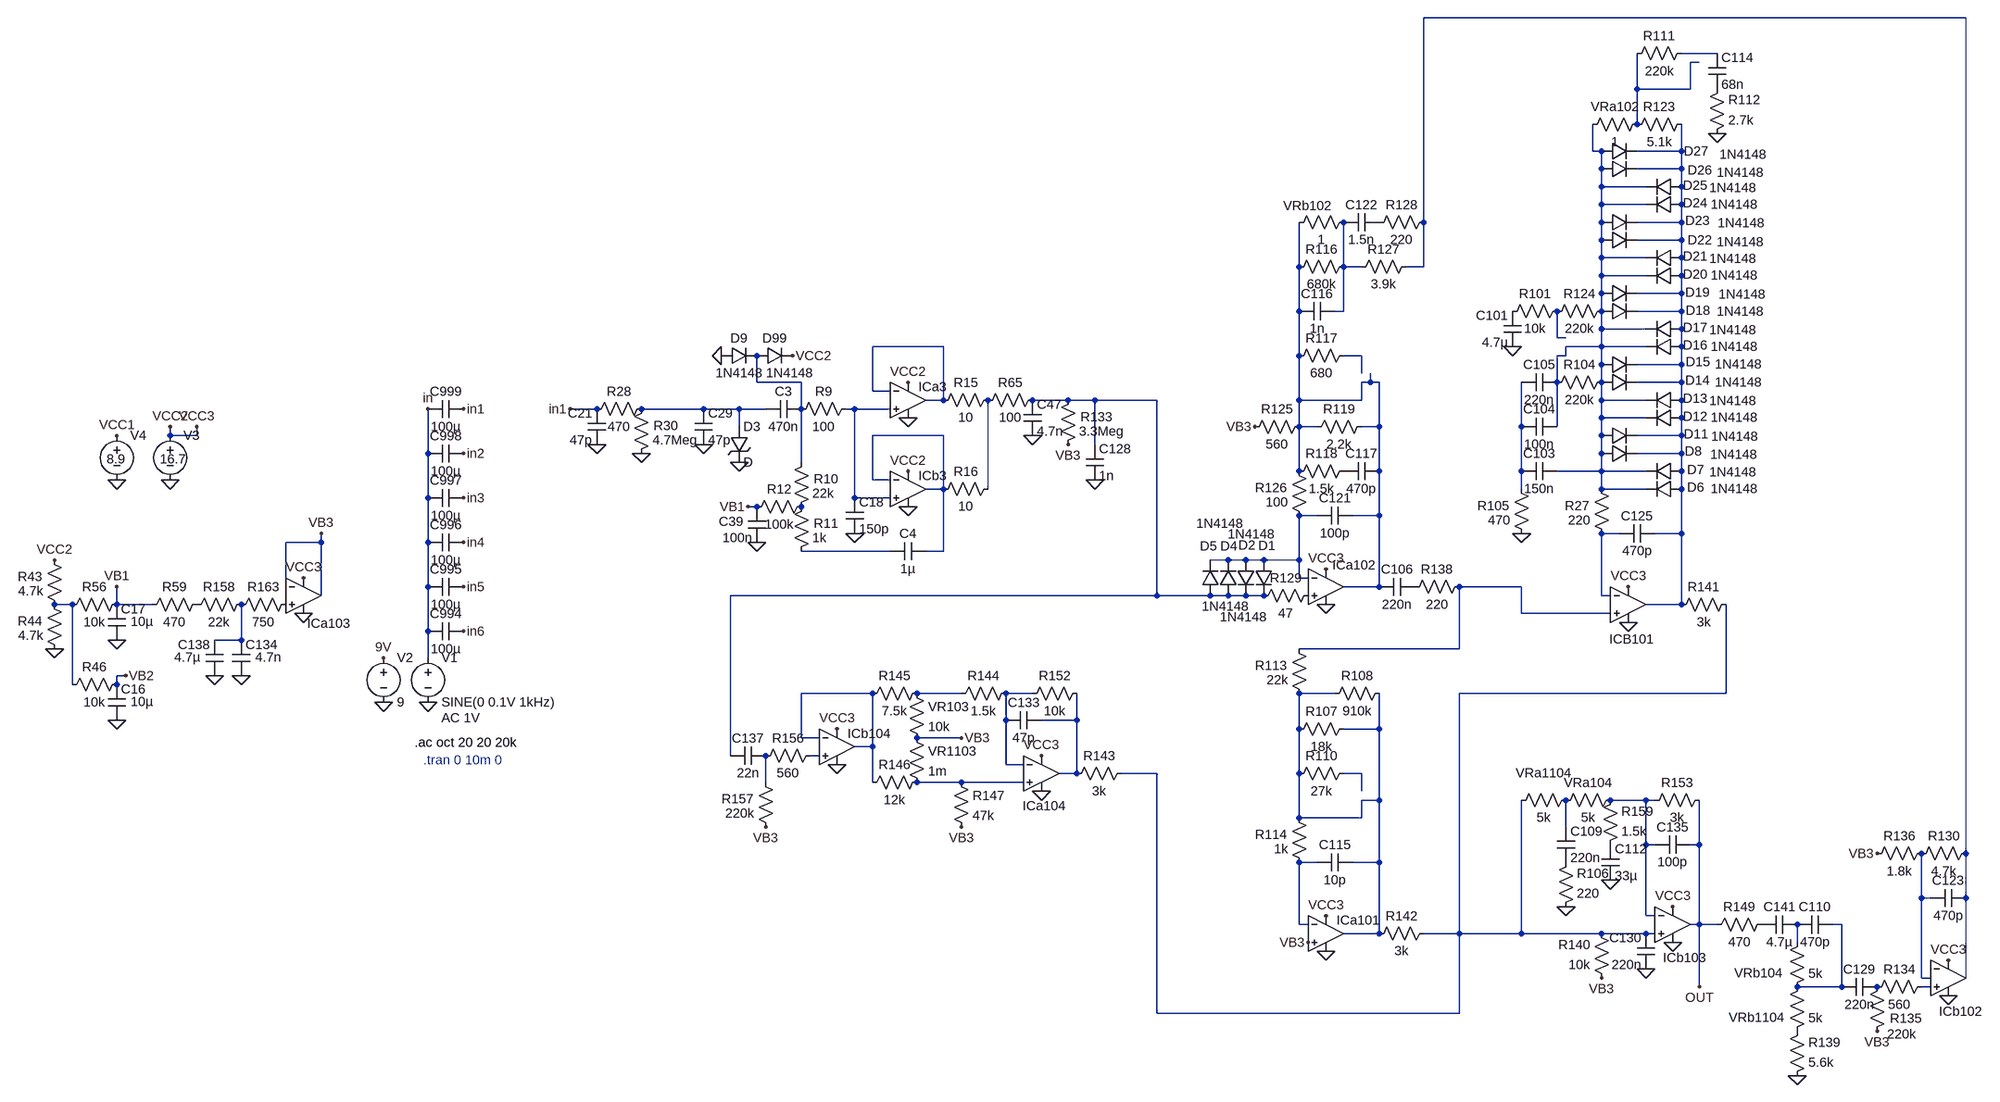
[diagram p0: schematic HalcyonGreenOD.asc]
HalcyonGreenOD.asc, the LTspice schematic file:
Version 4
SHEET 1 5440 4756
WIRE 704 384 -272 384
WIRE 256 448 192 448
WIRE 224 464 208 464
WIRE 112 512 112 448
WIRE 208 512 208 464
WIRE 208 512 112 512
WIRE 112 576 112 512
WIRE 32 624 32 576
WIRE 48 624 32 624
WIRE 192 624 192 576
WIRE 192 624 112 624
WIRE 48 656 48 624
WIRE 192 656 192 624
WIRE 192 656 112 656
WIRE 48 688 48 656
WIRE 128 688 48 688
WIRE 192 688 192 656
WIRE 48 720 48 688
WIRE 128 720 48 720
WIRE 192 720 192 688
WIRE -272 752 -272 384
WIRE 48 752 48 720
WIRE 192 752 192 720
WIRE 192 752 112 752
WIRE 48 784 48 752
WIRE 192 784 192 752
WIRE 192 784 112 784
WIRE 48 816 48 784
WIRE 128 816 48 816
WIRE 192 816 192 784
WIRE -496 832 -496 752
WIRE -416 832 -416 752
WIRE -384 832 -416 832
WIRE -272 832 -272 752
WIRE -272 832 -304 832
WIRE 48 848 48 816
WIRE 128 848 48 848
WIRE 192 848 192 816
WIRE 48 880 48 848
WIRE 192 880 192 848
WIRE 192 880 112 880
WIRE -496 912 -496 832
WIRE -416 912 -416 832
WIRE -416 912 -432 912
WIRE 48 912 48 880
WIRE 192 912 192 880
WIRE 192 912 112 912
WIRE 48 944 48 912
WIRE 128 944 48 944
WIRE 192 944 192 912
WIRE -32 960 -32 912
WIRE -16 960 -32 960
WIRE -1136 976 -1264 976
WIRE 48 976 48 944
WIRE 48 976 -16 976
WIRE 128 976 48 976
WIRE 192 976 192 944
WIRE -496 992 -496 912
WIRE -384 992 -416 992
WIRE -16 992 -16 976
WIRE -16 992 -32 992
WIRE 48 1008 48 976
WIRE 192 1008 192 976
WIRE 192 1008 112 1008
WIRE -384 1024 -384 992
WIRE -1472 1040 -1472 992
WIRE -1392 1040 -1472 1040
WIRE -368 1040 -368 1024
WIRE -368 1040 -384 1040
WIRE -352 1040 -368 1040
WIRE -32 1040 -32 992
WIRE 48 1040 48 1008
WIRE 192 1040 192 1008
WIRE 192 1040 112 1040
WIRE -1264 1056 -1264 976
WIRE -1232 1056 -1264 1056
WIRE -1136 1072 -1136 976
WIRE -1136 1072 -1168 1072
WIRE -912 1072 -976 1072
WIRE -864 1072 -912 1072
WIRE -752 1072 -864 1072
WIRE -496 1072 -496 992
WIRE -384 1072 -384 1040
WIRE -384 1072 -496 1072
WIRE 48 1072 48 1040
WIRE 128 1072 48 1072
WIRE 192 1072 192 1040
WIRE -1760 1088 -1808 1088
WIRE -1568 1088 -1680 1088
WIRE -1504 1088 -1568 1088
WIRE -1456 1088 -1504 1088
WIRE -1392 1088 -1392 1040
WIRE -1296 1088 -1312 1088
WIRE -1232 1088 -1296 1088
WIRE 48 1104 48 1072
WIRE 128 1104 48 1104
WIRE 192 1104 192 1072
WIRE -1504 1120 -1504 1088
WIRE -496 1120 -496 1072
WIRE -464 1120 -496 1120
WIRE -352 1120 -352 1040
WIRE -352 1120 -384 1120
WIRE -96 1120 -96 1040
WIRE -32 1120 -32 1040
WIRE -2528 1136 -2528 1120
WIRE -2480 1136 -2480 1120
WIRE -2480 1136 -2528 1136
WIRE -1136 1136 -1264 1136
WIRE 48 1136 48 1104
WIRE 192 1136 192 1104
WIRE 192 1136 112 1136
WIRE -864 1152 -864 1072
WIRE -2064 1168 -2064 1088
WIRE 48 1168 48 1136
WIRE 192 1168 192 1136
WIRE 192 1168 112 1168
WIRE -1392 1184 -1392 1088
WIRE -496 1200 -496 1120
WIRE -352 1200 -352 1120
WIRE -96 1200 -96 1120
WIRE 48 1200 48 1168
WIRE 48 1200 -32 1200
WIRE 128 1200 48 1200
WIRE 192 1200 192 1168
WIRE -1264 1216 -1264 1136
WIRE -1232 1216 -1264 1216
WIRE -1136 1232 -1136 1136
WIRE -1136 1232 -1168 1232
WIRE -1056 1232 -1056 1072
WIRE -96 1232 -96 1200
WIRE 48 1232 48 1200
WIRE 128 1232 48 1232
WIRE 192 1232 192 1200
WIRE -2064 1248 -2064 1168
WIRE -1296 1248 -1296 1088
WIRE -1232 1248 -1296 1248
WIRE -1472 1264 -1488 1264
WIRE -464 1280 -496 1280
WIRE -352 1280 -352 1200
WIRE -352 1280 -400 1280
WIRE 80 1312 48 1312
WIRE 192 1312 192 1232
WIRE 192 1312 144 1312
WIRE -2256 1328 -2256 1312
WIRE -2256 1328 -2320 1328
WIRE -2064 1328 -2064 1248
WIRE -1232 1344 -1392 1344
WIRE -1136 1344 -1136 1232
WIRE -1136 1344 -1168 1344
WIRE -624 1360 -656 1360
WIRE -592 1360 -624 1360
WIRE -560 1360 -592 1360
WIRE -496 1360 -496 1280
WIRE -496 1360 -560 1360
WIRE -496 1392 -496 1360
WIRE -480 1392 -496 1392
WIRE -2320 1408 -2320 1328
WIRE -2064 1408 -2064 1328
WIRE -352 1408 -352 1280
WIRE -352 1408 -416 1408
WIRE -96 1408 -208 1408
WIRE -2256 1424 -2256 1328
WIRE -752 1424 -752 1072
WIRE -752 1424 -1520 1424
WIRE -656 1424 -752 1424
WIRE -624 1424 -656 1424
WIRE -592 1424 -624 1424
WIRE -560 1424 -592 1424
WIRE 48 1424 48 1312
WIRE 64 1424 48 1424
WIRE -2704 1440 -2736 1440
WIRE -2624 1440 -2624 1408
WIRE -2560 1440 -2624 1440
WIRE 192 1440 192 1312
WIRE 192 1440 128 1440
WIRE -96 1456 -96 1408
WIRE 64 1456 -96 1456
WIRE -2064 1488 -2064 1408
WIRE -2400 1504 -2400 1440
WIRE -2400 1504 -2448 1504
WIRE -208 1520 -208 1408
WIRE -208 1520 -496 1520
WIRE -2064 1536 -2064 1488
WIRE -2608 1568 -2624 1568
WIRE -2704 1584 -2704 1440
WIRE -2624 1584 -2624 1568
WIRE -1264 1600 -1392 1600
WIRE -1104 1600 -1184 1600
WIRE -976 1600 -1024 1600
WIRE -432 1600 -496 1600
WIRE 272 1600 272 1440
WIRE 272 1600 -208 1600
WIRE -1024 1648 -1024 1600
WIRE -896 1648 -896 1600
WIRE -896 1648 -960 1648
WIRE -496 1664 -496 1600
WIRE -352 1664 -352 1600
WIRE -352 1664 -416 1664
WIRE -1392 1680 -1392 1600
WIRE -1360 1680 -1392 1680
WIRE -1104 1680 -1184 1680
WIRE -1264 1696 -1264 1600
WIRE -1264 1696 -1296 1696
WIRE -1520 1712 -1520 1424
WIRE -1360 1712 -1376 1712
WIRE -1024 1728 -1024 1648
WIRE -992 1728 -1024 1728
WIRE -896 1744 -896 1648
WIRE -896 1744 -928 1744
WIRE -752 1744 -816 1744
WIRE -496 1744 -496 1664
WIRE -384 1744 -416 1744
WIRE -1456 1760 -1456 1712
WIRE -1264 1760 -1264 1696
WIRE -1104 1760 -1184 1760
WIRE -992 1760 -1104 1760
WIRE -384 1776 -384 1744
WIRE -352 1792 -352 1664
WIRE -352 1792 -384 1792
WIRE 128 1792 64 1792
WIRE 144 1792 128 1792
WIRE -496 1824 -496 1744
WIRE -384 1824 -384 1792
WIRE -384 1824 -496 1824
WIRE -16 1840 -16 1792
WIRE 128 1872 128 1792
WIRE 144 1872 128 1872
WIRE 224 1872 224 1792
WIRE 224 1872 208 1872
WIRE 704 1888 704 384
WIRE -464 1904 -496 1904
WIRE -352 1904 -352 1792
WIRE -352 1904 -400 1904
WIRE 624 1968 624 1888
WIRE 640 1968 624 1968
WIRE 704 1968 704 1888
WIRE 128 2000 128 1872
WIRE 144 2000 128 2000
WIRE -496 2016 -496 1904
WIRE -480 2016 -496 2016
WIRE 224 2016 224 1872
WIRE 224 2016 208 2016
WIRE 256 2016 224 2016
WIRE 480 2016 464 2016
WIRE -352 2032 -352 1904
WIRE -352 2032 -416 2032
WIRE -208 2032 -208 1600
WIRE -208 2032 -272 2032
WIRE -96 2032 -96 1792
WIRE -96 2032 -208 2032
WIRE 48 2032 -96 2032
WIRE 128 2032 48 2032
WIRE 144 2032 128 2032
WIRE 400 2048 400 2016
WIRE 624 2112 624 1968
WIRE 640 2112 640 2096
WIRE 640 2112 624 2112
WIRE 704 2112 704 1968
WIRE 224 2128 224 2016
WIRE 480 2128 480 2016
WIRE 480 2128 400 2128
WIRE 640 2128 624 2128
WIRE -752 2176 -752 1744
WIRE -208 2176 -208 2032
WIRE -208 2176 -752 2176
FLAG -2064 1616 0
FLAG -2064 1088 in
FLAG -2144 1616 0
FLAG -2000 1088 in1
FLAG -2000 1168 in2
FLAG -2000 1248 in3
FLAG -2000 1328 in4
FLAG -2000 1408 in5
FLAG -2000 1488 in6
FLAG -1808 1088 in1
FLAG -2144 1536 9V
FLAG -1680 1168 0
FLAG -1760 1152 0
FLAG -1568 1152 0
FLAG -1504 1184 0
FLAG -2624 1216 0
FLAG -2624 1136 VCC1
FLAG -1488 1264 VB1
FLAG -1472 1328 0
FLAG -1328 1664 VCC3
FLAG -1328 1728 0
FLAG -960 1712 VCC3
FLAG -960 1776 0
FLAG -1456 1840 VB3
FLAG -1104 1840 VB3
FLAG -1104 1680 VB3
FLAG -2528 1216 0
FLAG -2528 1120 VCC2
FLAG -2480 1120 VCC3
FLAG -2736 1360 VCC2
FLAG -2736 1520 0
FLAG -2624 1504 0
FLAG -2624 1648 0
FLAG -2624 1408 VB1
FLAG -2608 1568 VB2
FLAG -2448 1568 0
FLAG -2400 1568 0
FLAG -2288 1456 0
FLAG -2288 1392 VCC3
FLAG -2256 1312 VB3
FLAG -1536 992 0
FLAG -1408 992 VCC2
FLAG -1200 1104 0
FLAG -1200 1040 VCC2
FLAG -1200 1264 0
FLAG -1200 1200 VCC2
FLAG -1296 1312 0
FLAG -976 1136 0
FLAG -864 1216 0
FLAG -912 1152 VB3
FLAG -448 1376 VCC3
FLAG -448 1440 0
FLAG -576 1120 VB3
FLAG -448 2000 VCC3
FLAG -448 2064 0
FLAG -480 2048 VB3
FLAG 96 1408 VCC3
FLAG 96 1472 0
FLAG -96 1312 0
FLAG -112 976 0
FLAG 256 592 0
FLAG 176 1984 VCC3
FLAG 176 2048 0
FLAG 128 2096 0
FLAG 48 2112 VB3
FLAG 64 1936 0
FLAG -16 1984 0
FLAG 400 2288 0
FLAG 544 2208 VB3
FLAG 672 2144 0
FLAG 672 2080 VCC3
FLAG 544 1888 VB3
FLAG 224 2128 OUT
SYMBOL voltage -2064 1520 R0
WINDOW 123 24 124 Left 2
WINDOW 39 0 0 Left 2
SYMATTR Value2 AC 1V
SYMATTR InstName V1
SYMATTR Value SINE(0 0.1V 1kHz)
SYMBOL voltage -2144 1520 R0
WINDOW 123 0 0 Left 0
WINDOW 39 0 0 Left 0
SYMATTR InstName V2
SYMATTR Value 9
SYMBOL cap -2000 1152 R90
WINDOW 0 0 32 VBottom 2
WINDOW 3 32 32 VTop 2
SYMATTR InstName C998
SYMATTR Value 100µ
SYMBOL cap -2000 1232 R90
WINDOW 0 0 32 VBottom 2
WINDOW 3 32 32 VTop 2
SYMATTR InstName C997
SYMATTR Value 100µ
SYMBOL cap -2000 1312 R90
WINDOW 0 0 32 VBottom 2
WINDOW 3 32 32 VTop 2
SYMATTR InstName C996
SYMATTR Value 100µ
SYMBOL cap -2000 1072 R90
WINDOW 0 0 32 VBottom 2
WINDOW 3 32 32 VTop 2
SYMATTR InstName C999
SYMATTR Value 100µ
SYMBOL cap -2000 1392 R90
WINDOW 0 0 32 VBottom 2
WINDOW 3 32 32 VTop 2
SYMATTR InstName C995
SYMATTR Value 100µ
SYMBOL cap -2000 1472 R90
WINDOW 0 0 32 VBottom 2
WINDOW 3 32 32 VTop 2
SYMATTR InstName C994
SYMATTR Value 100µ
SYMBOL cap -1744 1152 R180
WINDOW 0 24 56 Left 2
WINDOW 3 24 8 Left 2
SYMATTR InstName C21
SYMATTR Value 47p
SYMBOL res -1696 1184 M180
WINDOW 0 38 66 Left 2
WINDOW 3 36 40 Left 2
SYMATTR InstName R30
SYMATTR Value 4.7Meg
SYMBOL res -1664 1072 R90
WINDOW 0 0 56 VBottom 2
WINDOW 3 32 56 VTop 2
SYMATTR InstName R28
SYMATTR Value 470
SYMBOL cap -1584 1152 M180
WINDOW 0 24 56 Left 2
WINDOW 3 24 8 Left 2
SYMATTR InstName C29
SYMATTR Value 47p
SYMBOL TVSdiode -1520 1120 R0
SYMATTR InstName D3
SYMBOL cap -1392 1072 R90
WINDOW 0 0 32 VBottom 2
WINDOW 3 32 32 VTop 2
SYMATTR InstName C3
SYMATTR Value 470n
SYMBOL res -1408 1280 M180
WINDOW 0 38 66 Left 2
WINDOW 3 36 40 Left 2
SYMATTR InstName R10
SYMATTR Value 22k
SYMBOL voltage -2624 1120 R0
WINDOW 123 0 0 Left 0
WINDOW 39 0 0 Left 0
WINDOW 3 -18 58 Left 2
SYMATTR Value 8.9
SYMATTR InstName V4
SYMBOL res -1488 1280 R270
WINDOW 0 32 56 VTop 2
WINDOW 3 0 56 VBottom 2
SYMATTR InstName R12
SYMATTR Value 100k
SYMBOL cap -1456 1328 R180
WINDOW 0 40 37 Left 2
WINDOW 3 24 8 Left 2
SYMATTR InstName C39
SYMATTR Value 100n
SYMBOL diode -1472 976 M90
WINDOW 0 0 32 VBottom 2
WINDOW 3 32 59 VTop 2
SYMATTR InstName D99
SYMATTR Value 1N4148
SYMBOL Opamps\\UniversalOpamp2 -1328 1696 R0
WINDOW 0 19 -24 Left 2
SYMATTR InstName ICb104
SYMBOL cap -1456 1696 R90
WINDOW 0 0 32 VBottom 2
WINDOW 3 32 32 VTop 2
SYMATTR InstName C137
SYMATTR Value 22n
SYMBOL res -1440 1856 R180
WINDOW 0 38 66 Left 2
WINDOW 3 36 40 Left 2
SYMATTR InstName R157
SYMATTR Value 220k
SYMBOL res -1360 1696 R90
WINDOW 0 0 56 VBottom 2
WINDOW 3 32 56 VTop 2
SYMATTR InstName R156
SYMATTR Value 560
SYMBOL res -1168 1584 R90
WINDOW 0 0 56 VBottom 2
WINDOW 3 32 56 VTop 2
SYMATTR InstName R145
SYMATTR Value 7.5k
SYMBOL res -1168 1744 R90
WINDOW 0 0 56 VBottom 2
WINDOW 3 32 56 VTop 2
SYMATTR InstName R146
SYMATTR Value 12k
SYMBOL res -1200 1584 R0
SYMATTR InstName VR103
SYMATTR Value 10k
SYMBOL res -1200 1664 R0
SYMATTR InstName VR1103
SYMATTR Value 1m
SYMBOL res -1120 1744 R0
SYMATTR InstName R147
SYMATTR Value 47k
SYMBOL Opamps\\UniversalOpamp2 -960 1744 R0
WINDOW 0 -34 58 Left 2
SYMATTR InstName ICa104
SYMBOL res -1008 1584 R90
WINDOW 0 0 56 VBottom 2
WINDOW 3 32 56 VTop 2
SYMATTR InstName R144
SYMATTR Value 1.5k
SYMBOL cap -960 1632 R90
WINDOW 0 0 32 VBottom 2
WINDOW 3 32 32 VTop 2
SYMATTR InstName C133
SYMATTR Value 47p
SYMBOL res -880 1584 R90
WINDOW 0 0 56 VBottom 2
WINDOW 3 32 56 VTop 2
SYMATTR InstName R152
SYMATTR Value 10k
SYMBOL voltage -2528 1120 R0
WINDOW 123 0 0 Left 0
WINDOW 39 0 0 Left 0
WINDOW 3 -18 58 Left 2
SYMATTR Value 16.7
SYMATTR InstName V3
SYMBOL res -2720 1456 R180
WINDOW 0 38 66 Left 2
WINDOW 3 36 40 Left 2
SYMATTR InstName R43
SYMATTR Value 4.7k
SYMBOL res -2720 1536 R180
WINDOW 0 38 66 Left 2
WINDOW 3 36 40 Left 2
SYMATTR InstName R44
SYMATTR Value 4.7k
SYMBOL res -2608 1424 R90
WINDOW 0 0 56 VBottom 2
WINDOW 3 32 56 VTop 2
SYMATTR InstName R56
SYMATTR Value 10k
SYMBOL res -2608 1568 R90
WINDOW 0 0 56 VBottom 2
WINDOW 3 32 56 VTop 2
SYMATTR InstName R46
SYMATTR Value 10k
SYMBOL cap -2640 1504 M180
WINDOW 0 24 56 Left 2
WINDOW 3 41 33 Left 2
SYMATTR InstName C17
SYMATTR Value 10µ
SYMBOL cap -2640 1648 M180
WINDOW 0 24 56 Left 2
WINDOW 3 41 33 Left 2
SYMATTR InstName C16
SYMATTR Value 10µ
SYMBOL res -2464 1424 R90
WINDOW 0 0 56 VBottom 2
WINDOW 3 32 56 VTop 2
SYMATTR InstName R59
SYMATTR Value 470
SYMBOL res -2384 1424 R90
WINDOW 0 0 56 VBottom 2
WINDOW 3 32 56 VTop 2
SYMATTR InstName R158
SYMATTR Value 22k
SYMBOL res -2304 1424 R90
WINDOW 0 0 56 VBottom 2
WINDOW 3 32 56 VTop 2
SYMATTR InstName R163
SYMATTR Value 750
SYMBOL cap -2432 1568 R180
WINDOW 0 24 56 Left 2
WINDOW 3 41 33 Left 2
SYMATTR InstName C138
SYMATTR Value 4.7µ
SYMBOL cap -2416 1568 M180
WINDOW 0 24 56 Left 2
WINDOW 3 41 33 Left 2
SYMATTR InstName C134
SYMATTR Value 4.7n
SYMBOL Opamps\\UniversalOpamp2 -2288 1424 R0
WINDOW 0 7 50 Left 2
SYMATTR InstName ICa103
SYMBOL diode -1536 976 M90
WINDOW 0 0 32 VBottom 2
WINDOW 3 32 32 VTop 2
SYMATTR InstName D9
SYMATTR Value 1N4148
SYMBOL Opamps\\UniversalOpamp2 -1200 1072 R0
WINDOW 0 19 -24 Left 2
SYMATTR InstName ICa3
SYMBOL res -1296 1072 R90
WINDOW 0 0 56 VBottom 2
WINDOW 3 32 56 VTop 2
SYMATTR InstName R9
SYMATTR Value 100
SYMBOL Opamps\\UniversalOpamp2 -1200 1232 R0
WINDOW 0 19 -24 Left 2
SYMATTR InstName ICb3
SYMBOL cap -1312 1312 M180
WINDOW 0 24 56 Left 2
WINDOW 3 24 8 Left 2
SYMATTR InstName C18
SYMATTR Value 150p
SYMBOL cap -1168 1328 R90
WINDOW 0 0 32 VBottom 2
WINDOW 3 32 32 VTop 2
SYMATTR InstName C4
SYMATTR Value 1µ
SYMBOL res -1408 1360 M180
WINDOW 0 38 66 Left 2
WINDOW 3 36 40 Left 2
SYMATTR InstName R11
SYMATTR Value 1k
SYMBOL res -1040 1056 R90
WINDOW 0 0 56 VBottom 2
WINDOW 3 32 56 VTop 2
SYMATTR InstName R15
SYMATTR Value 10
SYMBOL res -1040 1216 R90
WINDOW 0 0 56 VBottom 2
WINDOW 3 32 56 VTop 2
SYMATTR InstName R16
SYMATTR Value 10
SYMBOL res -464 1408 R90
WINDOW 0 0 56 VBottom 2
WINDOW 3 32 56 VTop 2
SYMATTR InstName R129
SYMATTR Value 47
SYMBOL cap -992 1136 M180
WINDOW 0 24 56 Left 2
WINDOW 3 24 8 Left 2
SYMATTR InstName C47
SYMATTR Value 4.7n
SYMBOL res -928 1168 M180
WINDOW 0 38 66 Left 2
WINDOW 3 36 40 Left 2
SYMATTR InstName R133
SYMATTR Value 3.3Meg
SYMBOL cap -880 1216 M180
WINDOW 0 24 56 Left 2
WINDOW 3 24 8 Left 2
SYMATTR InstName C128
SYMATTR Value 1n
SYMBOL Opamps\\UniversalOpamp2 -448 1408 R0
WINDOW 0 12 -39 Left 2
SYMATTR InstName ICa102
SYMBOL diode -544 1360 M0
WINDOW 0 -5 -26 Left 2
WINDOW 3 10 102 Left 2
SYMATTR InstName D1
SYMATTR Value 1N4148
SYMBOL diode -576 1360 M0
WINDOW 0 -1 -27 Left 2
WINDOW 3 -36 -47 Left 2
SYMATTR InstName D2
SYMATTR Value 1N4148
SYMBOL diode -640 1424 M180
WINDOW 0 2 89 Left 2
WINDOW 3 -31 -19 Left 2
SYMATTR InstName D4
SYMATTR Value 1N4148
SYMBOL diode -672 1424 M180
WINDOW 0 -3 89 Left 2
WINDOW 3 -9 130 Left 2
SYMATTR InstName D5
SYMATTR Value 1N4148
SYMBOL cap -464 1264 M90
WINDOW 0 0 32 VBottom 2
WINDOW 3 32 32 VTop 2
SYMATTR InstName C121
SYMATTR Value 100p
SYMBOL cap -416 1184 M90
WINDOW 0 0 32 VBottom 2
WINDOW 3 32 32 VTop 2
SYMATTR InstName C117
SYMATTR Value 470p
SYMBOL res -400 1184 R90
WINDOW 0 0 56 VBottom 2
WINDOW 3 32 56 VTop 2
SYMATTR InstName R118
SYMATTR Value 1.5k
SYMBOL res -480 1104 R90
WINDOW 0 0 56 VBottom 2
WINDOW 3 32 56 VTop 2
SYMATTR InstName R125
SYMATTR Value 560
SYMBOL res -960 1056 R90
WINDOW 0 0 56 VBottom 2
WINDOW 3 32 56 VTop 2
SYMATTR InstName R65
SYMATTR Value 100
SYMBOL res -400 976 R90
WINDOW 0 0 56 VBottom 2
WINDOW 3 32 56 VTop 2
SYMATTR InstName R117
SYMATTR Value 680
SYMBOL cap -496 896 M90
WINDOW 0 0 32 VBottom 2
WINDOW 3 32 32 VTop 2
SYMATTR InstName C116
SYMATTR Value 1n
SYMBOL res -400 816 R90
WINDOW 0 0 56 VBottom 2
WINDOW 3 32 56 VTop 2
SYMATTR InstName R116
SYMATTR Value 680k
SYMBOL res -400 736 R90
WINDOW 0 2 81 VBottom 2
WINDOW 3 32 56 VTop 2
SYMATTR InstName VRb102
SYMATTR Value 1
SYMBOL cap -416 736 M90
WINDOW 0 0 32 VBottom 2
WINDOW 3 32 32 VTop 2
SYMATTR InstName C122
SYMATTR Value 1.5n
SYMBOL res -256 736 R90
WINDOW 0 0 56 VBottom 2
WINDOW 3 32 56 VTop 2
SYMATTR InstName R128
SYMATTR Value 220
SYMBOL res -288 816 R90
WINDOW 0 0 56 VBottom 2
WINDOW 3 32 56 VTop 2
SYMATTR InstName R127
SYMATTR Value 3.9k
SYMBOL cap -352 1392 M90
WINDOW 0 0 32 VBottom 2
WINDOW 3 32 32 VTop 2
SYMATTR InstName C106
SYMATTR Value 220n
SYMBOL res -192 1392 R90
WINDOW 0 0 56 VBottom 2
WINDOW 3 32 56 VTop 2
SYMATTR InstName R138
SYMATTR Value 220
SYMBOL res -480 1296 R180
WINDOW 0 38 66 Left 2
WINDOW 3 36 40 Left 2
SYMATTR InstName R126
SYMATTR Value 100
SYMBOL Opamps\\UniversalOpamp2 -448 2032 R0
WINDOW 0 19 -24 Left 2
SYMATTR InstName ICa101
SYMBOL cap -464 1888 M90
WINDOW 0 0 32 VBottom 2
WINDOW 3 32 32 VTop 2
SYMATTR InstName C115
SYMATTR Value 10p
SYMBOL res -400 1728 R90
WINDOW 0 0 56 VBottom 2
WINDOW 3 32 56 VTop 2
SYMATTR InstName R110
SYMATTR Value 27k
SYMBOL res -400 1648 R90
WINDOW 0 0 56 VBottom 2
WINDOW 3 32 56 VTop 2
SYMATTR InstName R107
SYMATTR Value 18k
SYMBOL res -336 1584 R90
WINDOW 0 0 56 VBottom 2
WINDOW 3 32 56 VTop 2
SYMATTR InstName R108
SYMATTR Value 910k
SYMBOL res -256 2016 R90
WINDOW 0 0 56 VBottom 2
WINDOW 3 32 56 VTop 2
SYMATTR InstName R142
SYMATTR Value 3k
SYMBOL res -480 1920 R180
WINDOW 0 38 66 Left 2
WINDOW 3 36 40 Left 2
SYMATTR InstName R114
SYMATTR Value 1k
SYMBOL res -480 1616 R180
WINDOW 0 38 66 Left 2
WINDOW 3 36 40 Left 2
SYMATTR InstName R113
SYMATTR Value 22k
SYMBOL Opamps\\UniversalOpamp2 96 1440 R0
WINDOW 0 -34 62 Left 2
SYMATTR InstName ICB101
SYMBOL cap 80 1296 M90
WINDOW 0 0 32 VBottom 2
WINDOW 3 32 32 VTop 2
SYMATTR InstName C125
SYMATTR Value 470p
SYMBOL res 288 1424 R90
WINDOW 0 0 56 VBottom 2
WINDOW 3 32 56 VTop 2
SYMATTR InstName R141
SYMATTR Value 3k
SYMBOL res 64 1328 R180
WINDOW 0 38 66 Left 2
WINDOW 3 36 40 Left 2
SYMATTR InstName R27
SYMATTR Value 220
SYMBOL diode 192 1248 M270
WINDOW 0 3 -25 VTop 2
WINDOW 3 32 -95 VBottom 2
SYMATTR InstName D6
SYMATTR Value 1N4148
SYMBOL diode 192 1216 M270
WINDOW 0 3 -25 VTop 2
WINDOW 3 30 -92 VBottom 2
SYMATTR InstName D7
SYMATTR Value 1N4148
SYMBOL diode 48 1184 R270
WINDOW 0 4 165 VTop 2
WINDOW 3 30 238 VBottom 2
SYMATTR InstName D8
SYMATTR Value 1N4148
SYMBOL diode 48 1152 R270
WINDOW 0 3 170 VTop 2
WINDOW 3 30 240 VBottom 2
SYMATTR InstName D11
SYMATTR Value 1N4148
SYMBOL diode 192 1120 M270
WINDOW 0 3 -25 VTop 2
WINDOW 3 32 -95 VBottom 2
SYMATTR InstName D12
SYMATTR Value 1N4148
SYMBOL diode 192 1088 M270
WINDOW 0 3 -25 VTop 2
WINDOW 3 30 -92 VBottom 2
SYMATTR InstName D13
SYMATTR Value 1N4148
SYMBOL diode 48 1056 R270
WINDOW 0 4 173 VTop 2
WINDOW 3 32 246 VBottom 2
SYMATTR InstName D14
SYMATTR Value 1N4148
SYMBOL diode 48 1024 R270
WINDOW 0 5 174 VTop 2
WINDOW 3 32 246 VBottom 2
SYMATTR InstName D15
SYMATTR Value 1N4148
SYMBOL diode 192 992 M270
WINDOW 0 3 -25 VTop 2
WINDOW 3 32 -95 VBottom 2
SYMATTR InstName D16
SYMATTR Value 1N4148
SYMBOL diode 192 960 M270
WINDOW 0 3 -25 VTop 2
WINDOW 3 30 -92 VBottom 2
SYMATTR InstName D17
SYMATTR Value 1N4148
SYMBOL diode 48 928 R270
WINDOW 0 2 174 VTop 2
WINDOW 3 31 250 VBottom 2
SYMATTR InstName D18
SYMATTR Value 1N4148
SYMBOL diode 48 896 R270
WINDOW 0 2 173 VTop 2
WINDOW 3 30 253 VBottom 2
SYMATTR InstName D19
SYMATTR Value 1N4148
SYMBOL diode 192 864 M270
WINDOW 0 3 -25 VTop 2
WINDOW 3 32 -95 VBottom 2
SYMATTR InstName D20
SYMATTR Value 1N4148
SYMBOL diode 192 832 M270
WINDOW 0 3 -25 VTop 2
WINDOW 3 30 -92 VBottom 2
SYMATTR InstName D21
SYMATTR Value 1N4148
SYMBOL diode 48 800 R270
WINDOW 0 0 177 VTop 2
WINDOW 3 28 250 VBottom 2
SYMATTR InstName D22
SYMATTR Value 1N4148
SYMBOL diode 48 768 R270
WINDOW 0 3 173 VTop 2
WINDOW 3 30 251 VBottom 2
SYMATTR InstName D23
SYMATTR Value 1N4148
SYMBOL diode 192 736 M270
WINDOW 0 3 -25 VTop 2
WINDOW 3 32 -95 VBottom 2
SYMATTR InstName D24
SYMATTR Value 1N4148
SYMBOL diode 192 704 M270
WINDOW 0 3 -25 VTop 2
WINDOW 3 30 -92 VBottom 2
SYMATTR InstName D25
SYMATTR Value 1N4148
SYMBOL diode 48 672 R270
WINDOW 0 -2 177 VTop 2
WINDOW 3 25 250 VBottom 2
SYMATTR InstName D26
SYMATTR Value 1N4148
SYMBOL diode 48 640 R270
WINDOW 0 0 170 VTop 2
WINDOW 3 26 255 VBottom 2
SYMATTR InstName D27
SYMATTR Value 1N4148
SYMBOL res 64 1024 R90
WINDOW 0 0 56 VBottom 2
WINDOW 3 32 56 VTop 2
SYMATTR InstName R104
SYMATTR Value 220k
SYMBOL cap -96 1024 M90
WINDOW 0 0 32 VBottom 2
WINDOW 3 32 32 VTop 2
SYMATTR InstName C105
SYMATTR Value 220n
SYMBOL cap -96 1104 M90
WINDOW 0 0 32 VBottom 2
WINDOW 3 32 32 VTop 2
SYMATTR InstName C104
SYMATTR Value 100n
SYMBOL cap -96 1184 M90
WINDOW 0 0 32 VBottom 2
WINDOW 3 32 32 VTop 2
SYMATTR InstName C103
SYMATTR Value 150n
SYMBOL res -80 1328 R180
WINDOW 0 38 66 Left 2
WINDOW 3 36 40 Left 2
SYMATTR InstName R105
SYMATTR Value 470
SYMBOL res 64 896 R90
WINDOW 0 0 56 VBottom 2
WINDOW 3 32 56 VTop 2
SYMATTR InstName R124
SYMATTR Value 220k
SYMBOL res -16 896 R90
WINDOW 0 0 56 VBottom 2
WINDOW 3 32 56 VTop 2
SYMATTR InstName R101
SYMATTR Value 10k
SYMBOL cap -96 912 M0
SYMATTR InstName C101
SYMATTR Value 4.7µ
SYMBOL res 208 560 R90
WINDOW 0 0 56 VBottom 2
WINDOW 3 32 56 VTop 2
SYMATTR InstName R123
SYMATTR Value 5.1k
SYMBOL res 128 560 R90
WINDOW 0 0 56 VBottom 2
WINDOW 3 32 56 VTop 2
SYMATTR InstName VRa102
SYMATTR Value 1
SYMBOL res 208 432 R90
WINDOW 0 0 56 VBottom 2
WINDOW 3 32 56 VTop 2
SYMATTR InstName R111
SYMATTR Value 220k
SYMBOL cap 240 448 R0
SYMATTR InstName C114
SYMATTR Value 68n
SYMBOL res 240 608 M180
WINDOW 0 36 76 Left 2
WINDOW 3 36 40 Left 2
SYMATTR InstName R112
SYMATTR Value 2.7k
SYMBOL res -800 1728 R90
WINDOW 0 0 56 VBottom 2
WINDOW 3 32 56 VTop 2
SYMATTR InstName R143
SYMATTR Value 3k
SYMBOL Opamps\\UniversalOpamp2 176 2016 R0
WINDOW 0 -17 60 Left 2
SYMATTR InstName ICb103
SYMBOL cap 144 1856 M90
WINDOW 0 0 32 VBottom 2
WINDOW 3 32 32 VTop 2
SYMATTR InstName C135
SYMATTR Value 100p
SYMBOL res 240 1776 R90
WINDOW 0 0 56 VBottom 2
WINDOW 3 32 56 VTop 2
SYMATTR InstName R153
SYMATTR Value 3k
SYMBOL cap 144 2032 M0
SYMATTR InstName C130
SYMATTR Value 220n
SYMBOL res 64 2128 R180
WINDOW 0 36 76 Left 2
WINDOW 3 36 40 Left 2
SYMATTR InstName R140
SYMATTR Value 10k
SYMBOL res 48 1888 M180
WINDOW 0 36 76 Left 2
WINDOW 3 36 40 Left 2
SYMATTR InstName R159
SYMATTR Value 1.5k
SYMBOL cap 48 1872 R0
SYMATTR InstName C112
SYMATTR Value 33µ
SYMBOL res 80 1776 R90
WINDOW 0 0 56 VBottom 2
WINDOW 3 32 56 VTop 2
SYMATTR InstName VRa104
SYMATTR Value 5k
SYMBOL res 0 1776 R90
WINDOW 0 -17 56 VBottom 2
WINDOW 3 32 56 VTop 2
SYMATTR InstName VRa1104
SYMATTR Value 5k
SYMBOL cap -32 1840 R0
SYMATTR InstName C109
SYMATTR Value 220n
SYMBOL res -32 2000 M180
WINDOW 0 36 76 Left 2
WINDOW 3 36 40 Left 2
SYMATTR InstName R106
SYMATTR Value 220
SYMBOL res 352 2000 R90
WINDOW 0 0 56 VBottom 2
WINDOW 3 32 56 VTop 2
SYMATTR InstName R149
SYMATTR Value 470
SYMBOL cap 336 2000 M90
WINDOW 0 0 32 VBottom 2
WINDOW 3 32 32 VTop 2
SYMATTR InstName C141
SYMATTR Value 4.7µ
SYMBOL cap 400 2000 M90
WINDOW 0 0 32 VBottom 2
WINDOW 3 32 32 VTop 2
SYMATTR InstName C110
SYMATTR Value 470p
SYMBOL res 384 2144 M180
WINDOW 0 -97 41 Left 2
WINDOW 3 36 40 Left 2
SYMATTR InstName VRb104
SYMATTR Value 5k
SYMBOL res 384 2224 M180
WINDOW 0 -107 41 Left 2
WINDOW 3 36 40 Left 2
SYMATTR InstName VRb1104
SYMATTR Value 5k
SYMBOL res 384 2304 M180
WINDOW 0 36 76 Left 2
WINDOW 3 36 40 Left 2
SYMATTR InstName R139
SYMATTR Value 5.6k
SYMBOL cap 544 2112 R90
WINDOW 0 0 32 VBottom 2
WINDOW 3 32 32 VTop 2
SYMATTR InstName C129
SYMATTR Value 220n
SYMBOL res 528 2224 M180
WINDOW 0 39 39 Left 2
WINDOW 3 34 11 Left 2
SYMATTR InstName R135
SYMATTR Value 220k
SYMBOL res 640 2112 R90
WINDOW 0 0 56 VBottom 2
WINDOW 3 32 56 VTop 2
SYMATTR InstName R134
SYMATTR Value 560
SYMBOL Opamps\\UniversalOpamp2 672 2112 R0
WINDOW 0 -17 60 Left 2
SYMATTR InstName ICb102
SYMBOL cap 640 1952 M90
WINDOW 0 0 32 VBottom 2
WINDOW 3 32 32 VTop 2
SYMATTR InstName C123
SYMATTR Value 470p
SYMBOL res 720 1872 R90
WINDOW 0 0 56 VBottom 2
WINDOW 3 32 56 VTop 2
SYMATTR InstName R130
SYMATTR Value 4.7k
SYMBOL res 640 1872 R90
WINDOW 0 0 56 VBottom 2
WINDOW 3 32 56 VTop 2
SYMATTR InstName R136
SYMATTR Value 1.8k
SYMBOL res -368 1104 R90
WINDOW 0 0 56 VBottom 2
WINDOW 3 32 56 VTop 2
SYMATTR InstName R119
SYMATTR Value 2.2k
TEXT -2088 1688 Left 2 !.ac oct 20 20 20k
TEXT -2072 1720 Left 2 ;.tran 0 10m 0

The netlist it stands for:
* HalcyonGreenOD.asc
V1 in 0 SINE(0 0.1V 1kHz) AC 1V
V2 9V 0 9
C998 in2 in 100µ
C997 in3 in 100µ
C996 in4 in 100µ
C999 in1 in 100µ
C995 in5 in 100µ
C994 in6 in 100µ
C21 0 in1 47p
R30 0 N013 4.7Meg
R28 N013 in1 470
C29 0 N013 47p
D3 N013 0 D
C3 N011 N013 470n
R10 P001 N011 22k
V4 VCC1 0 8.9
R12 VB1 P001 100k
C39 0 VB1 100n
D99 N011 VCC2 1N4148
XICb104 N030 N024 VCC2 0 N024 level.2 Avol=1Meg GBW=10Meg Slew=10Meg ilimit=25m rail=0 Vos=0 phimargin=45 en=0 enk=0 in=0 ink=0 Rin=500Meg  ; pins IN+ IN- V+ V- OUT
C137 N032 N012 22n
R157 VB3 N032 220k
R156 N030 N032 560
R145 N025 N024 7.5k
R146 N033 N024 12k
R§VR103 N025 VB3 10k
R§VR1103 VB3 N033 1m
R147 N033 VB3 47k
XICa104 N033 N026 VCC2 0 N029 level.2 Avol=1Meg GBW=10Meg Slew=10Meg ilimit=25m rail=0 Vos=0 phimargin=45 en=0 enk=0 in=0 ink=0 Rin=500Meg  ; pins IN+ IN- V+ V- OUT
R144 N026 N025 1.5k
C133 N029 N026 47p
R152 N029 N026 10k
V3 VCC2 0 16.7
R43 N022 VCC2 4.7k
R44 0 N022 4.7k
R56 VB1 N022 10k
R46 VB2 N022 10k
C17 0 VB1 10µ
C16 0 VB2 10µ
R59 P002 VB1 470
R158 N023 P002 22k
R163 P003 N023 750
C138 0 N023 4.7µ
C134 0 N023 4.7n
XICa103 P003 VB3 VCC2 0 VB3 level.2 Avol=1Meg GBW=10Meg Slew=10Meg ilimit=25m rail=0 Vos=0 phimargin=45 en=0 enk=0 in=0 ink=0 Rin=500Meg  ; pins IN+ IN- V+ V- OUT
D9 0 N011 1N4148
XICa3 N014 N009 VCC2 0 N009 level.2 Avol=1Meg GBW=10Meg Slew=10Meg ilimit=25m rail=0 Vos=0 phimargin=45 en=0 enk=0 in=0 ink=0 Rin=500Meg  ; pins IN+ IN- V+ V- OUT
R9 N014 N011 100
XICb3 N014 N016 VCC2 0 N016 level.2 Avol=1Meg GBW=10Meg Slew=10Meg ilimit=25m rail=0 Vos=0 phimargin=45 en=0 enk=0 in=0 ink=0 Rin=500Meg  ; pins IN+ IN- V+ V- OUT
C18 0 N014 150p
C4 N016 N020 1µ
R11 N020 P001 1k
R15 N017 N009 10
R16 N017 N016 10
R129 P004 N012 47
C47 0 N012 4.7n
R133 VB3 N012 3.3Meg
C128 0 N012 1n
XICa102 P004 N018 VCC2 0 N006 level.2 Avol=1Meg GBW=10Meg Slew=10Meg ilimit=25m rail=0 Vos=0 phimargin=45 en=0 enk=0 in=0 ink=0 Rin=500Meg  ; pins IN+ IN- V+ V- OUT
D1 N018 N012 1N4148
D2 N018 N012 1N4148
D4 N012 N018 1N4148
D5 N012 N018 1N4148
C121 N018 N006 100p
C117 P005 N006 470p
R118 P005 N006 1.5k
R125 N006 VB3 560
R65 N012 N017 100
R117 N010 N006 680
C116 N006 N007 1n
R116 N007 N006 680k
R§VRb102 N007 N006 1
C122 N007 P006 1.5n
R128 N001 P006 220
R127 N001 N007 3.9k
C106 N006 P007 220n
R138 N021 P007 220
R126 N018 N006 100
XICa101 VB3 N036 VCC2 0 N027 level.2 Avol=1Meg GBW=10Meg Slew=10Meg ilimit=25m rail=0 Vos=0 phimargin=45 en=0 enk=0 in=0 ink=0 Rin=500Meg  ; pins IN+ IN- V+ V- OUT
C115 N036 N027 10p
R110 N031 N027 27k
R107 N027 N027 18k
R108 N027 N027 910k
R142 N028 N027 3k
R114 N036 N027 1k
R113 N027 N021 22k
XICB101 N021 N019 VCC2 0 N005 level.2 Avol=1Meg GBW=10Meg Slew=10Meg ilimit=25m rail=0 Vos=0 phimargin=45 en=0 enk=0 in=0 ink=0 Rin=500Meg  ; pins IN+ IN- V+ V- OUT
C125 N019 N005 470p
R141 N028 N005 3k
R27 N019 N004 220
D6 N005 N004 1N4148
D7 N005 N004 1N4148
D8 N004 N005 1N4148
D11 N004 N005 1N4148
D12 N005 N004 1N4148
D13 N005 N004 1N4148
D14 N004 N005 1N4148
D15 N004 N005 1N4148
D16 N005 N004 1N4148
D17 N005 N004 1N4148
D18 N004 N005 1N4148
D19 N004 N005 1N4148
D20 N005 N004 1N4148
D21 N005 N004 1N4148
D22 N004 N005 1N4148
D23 N004 N005 1N4148
D24 N005 N004 1N4148
D25 N005 N004 1N4148
D26 N004 N005 1N4148
D27 N004 N005 1N4148
R104 N004 N004 220k
C105 N015 N004 220n
C104 N015 N004 100n
C103 N015 N004 150n
R105 0 N015 470
R124 N004 N008 220k
R101 N008 P008 10k
C101 P008 0 4.7µ
R123 N005 N003 5.1k
R§VRa102 N003 N004 1
R111 N002 N003 220k
C114 N002 P009 68n
R112 0 P009 2.7k
R143 N028 N029 3k
XICb103 N028 N034 VCC2 0 OUT level.2 Avol=1Meg GBW=10Meg Slew=10Meg ilimit=25m rail=0 Vos=0 phimargin=45 en=0 enk=0 in=0 ink=0 Rin=500Meg  ; pins IN+ IN- V+ V- OUT
C135 N034 OUT 100p
R153 OUT N034 3k
C130 N028 0 220n
R140 VB3 N028 10k
R159 P010 N034 1.5k
C112 P010 0 33µ
R§VRa104 N034 N035 5k
R§VRa1104 N035 N028 5k
C109 N035 P011 220n
R106 0 P011 220
R149 P012 OUT 470
C141 P012 N039 4.7µ
C110 N039 N038 470p
R§VRb104 N038 N039 5k
R§VRb1104 P013 N038 5k
R139 0 P013 5.6k
C129 P014 N038 220n
R135 VB3 P014 220k
R134 N040 P014 560
XICb102 N040 N037 VCC2 0 N001 level.2 Avol=1Meg GBW=10Meg Slew=10Meg ilimit=25m rail=0 Vos=0 phimargin=45 en=0 enk=0 in=0 ink=0 Rin=500Meg  ; pins IN+ IN- V+ V- OUT
C123 N037 N001 470p
R130 N001 N037 4.7k
R136 N037 VB3 1.8k
R119 N006 N006 2.2k
.model D D
.lib standard.dio
.ac oct 20 20 20k
* .tran 0 10m 0
.lib UniversalOpamps2.sub
.backanno
.end